# EAGLE design breakout_ina169 (EAGLE 7.5.0)
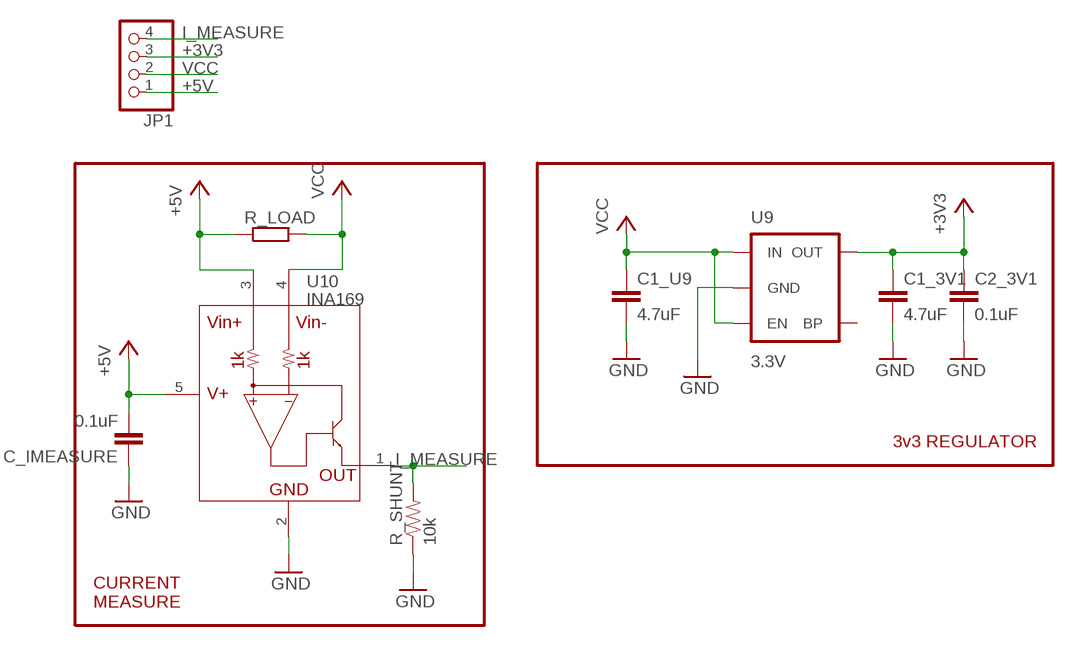
[diagram p0: schematic, sheet 1]

## Parts
C1_3V1  4.7uF  CAP0402-CAP  [0402-CAP]
C1_U9  4.7uF  CAP0402-CAP  [0402-CAP]
C2_3V1  0.1uF  CAP0402-CAP  [0402-CAP]
C_IMEASURE  0.1uF  CAP0603-CAP  [0603-CAP]
JP1  PINHD-1X4  [1X04]
R_LOAD  R-EU_0309/10  [0309/10]
R_SHUNT  10k  RESISTOR0603  [0603-RES]
U9  3.3V  V_REG_LDOSMD  [SOT23-5]
U10  INA169  [SOT23-5]

## Nets
+3V3: C1_3V1.1 C2_3V1.1 JP1.3 U9.5(OUT)
+5V [motor]: C_IMEASURE.2 JP1.1 R_LOAD.1 U10.3(VIN+) U10.5(V+)
GND [motor]: C1_3V1.2 C1_U9.2 C2_3V1.2 C_IMEASURE.1 R_SHUNT.1 U9.2(GND) U10.2(GND)
I_MEASURE: JP1.4 R_SHUNT.2 U10.1(OUT)
VCC [motor]: C1_U9.1 JP1.2 R_LOAD.2 U9.1(IN) U9.3(EN) U10.4(VIN-)
Unconnected: U9.4(BP)

## Notes on the sheet
- 3v3 REGULATOR
- CURRENT
  MEASURE

## Library data of the parts
C1_3V1 C1_U9 C2_3V1 = SparkFun:CAP: Capacitor Standard 0603 ceramic capacitor, and 0.1" leaded capacitor.
C_IMEASURE = SparkFun-Passives:CAP: Capacitor Standard 0603 ceramic capacitor, and 0.1" leaded capacitor.
JP1 = pinhead:PINHD-1X4: PIN HEADER
R_LOAD = resistor:R-EU_: RESISTOR, European symbol; SIZE: 1206; TOL: 1%
R_SHUNT = SparkFun-Resistors:RESISTOR: Resistor Basic schematic elements and footprints for 0603, 1206, and PTH resistors.; TOL: 1%
U9 = SparkFun:V_REG_LDO: Voltage Regulator LDO Standard 150mA LDO voltage regulator in SOT-23 layout. Micrel part MIC5205. BP (by-pass) pin is used to lower output noise with 470pF cap.
U10 = SparkFun-AnalogIC:INA169

## Net classes
0 default: clearance 0.205 mm
1 motor: width 0.406 mm, clearance 0.203 mm

## Board
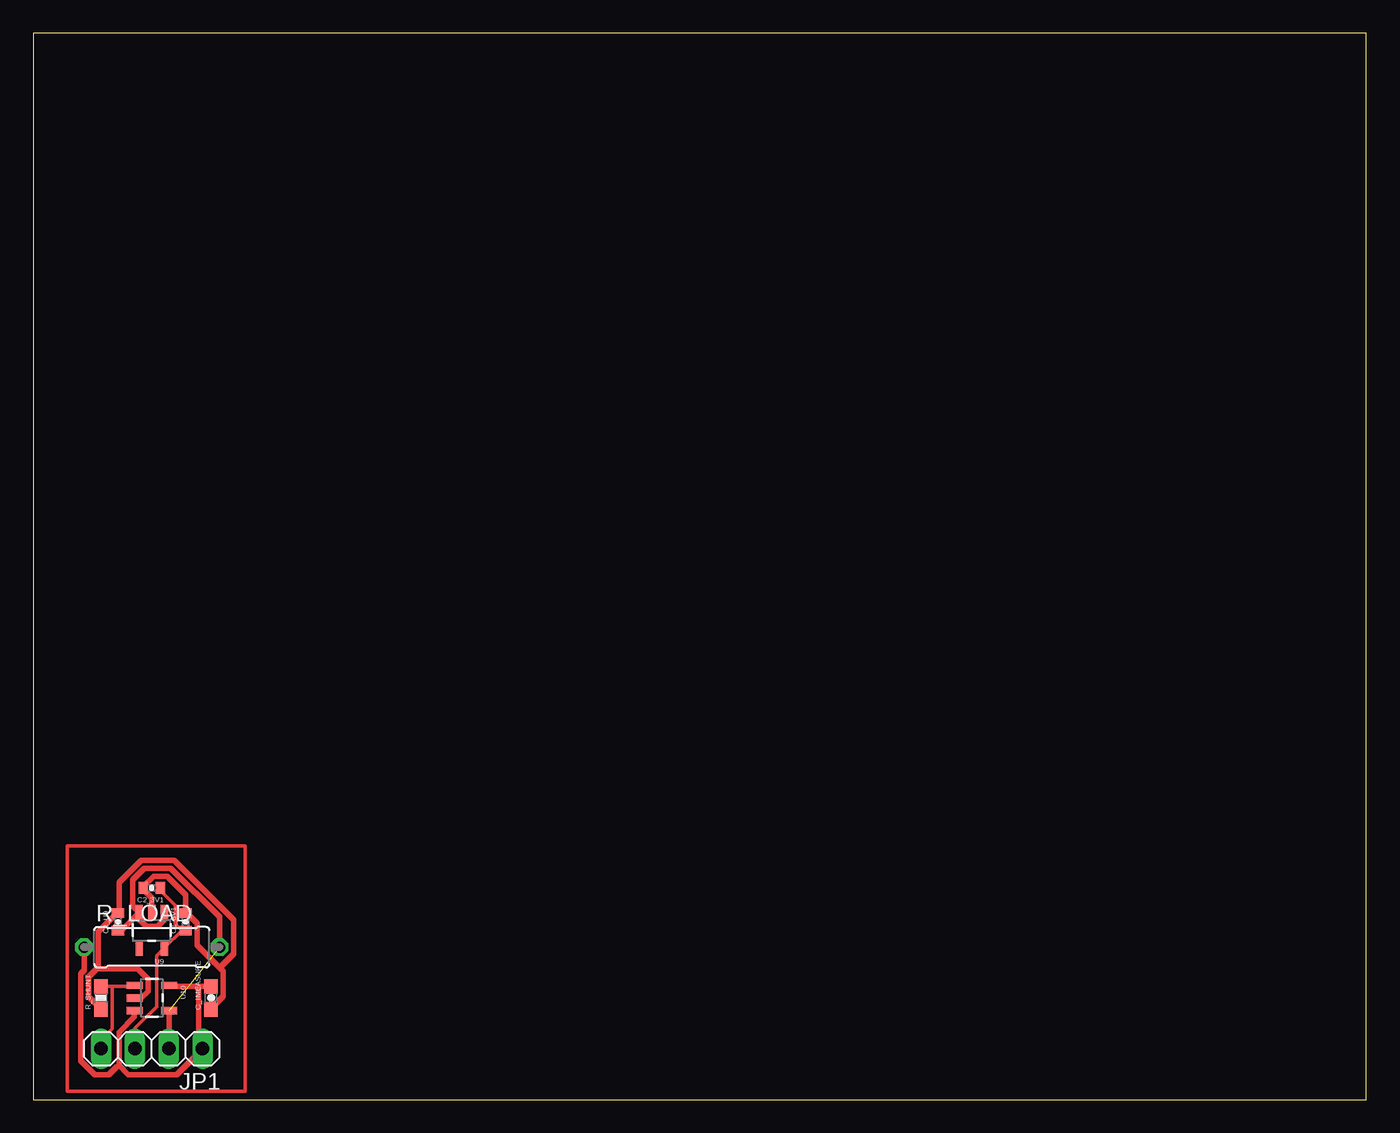
[diagram p1: board, top side]

Size 100 x 80 mm. Coordinates in mm from the lower left corner, seen from the top.
Outline: 0,0 100,0 100,80 0,80 0,0
Copper layers (1*16): Top 0.035mm / dielectric 1.5mm / Bottom 0.035mm
Design rules "default": minimum track width 10mil, minimum drill 24mil, track to track 8mil, track to pad 8mil, pad to pad 8mil, via to via 8mil, smd to smd 8mil, copper to edge 40mil, drill to drill 8mil, minimum pad ring 10mil, minimum via ring 8mil, stop-mask expansion 4mil, vias tented up to drill 0mil, thermal gap 10mil

### Footprints (pad centres in the part's own frame; a part is rotated, then mirrored left to right if it is on the bottom)
0402-CAP = smd 0.7 x 0.9: 1 -0.65,0; 2 0.65,0
0603-CAP = smd 1.1 x 1: 1 -0.85,0; 2 0.85,0
1X04 = drill 1.016 long: 1 -3.81,0; 2 -1.27,0; 3 1.27,0; 4 3.81,0
0309/10 = drill 0.813 octagon: 1 -5.08,0; 2 5.08,0
0603-RES = smd 1.1 x 1: 1 -0.85,0; 2 0.85,0
SOT23-5 = smd 0.55 x 1.2: 1 -0.95,-1.3; 2 0,-1.3; 3 0.95,-1.3; 4 0.95,1.3; 5 -0.95,1.3

### Placement (x,y rotation side)
C1_3V1  11.43,13.34 90 top
C1_U9  6.35,13.34 90 top
C2_3V1  8.89,15.88 180 top
C_IMEASURE  13.34,7.62 90 top
JP1  8.89,3.81 180 top
R_LOAD  8.89,11.43 0 top
R_SHUNT  5.08,7.62 90 top
U9  8.89,12.7 180 top
U10  8.89,7.62 270 top

### Tracks (layer width: path | path; a pad name or v marks a point on that pad's centre or on a via)
+3V3
  Top 0.254: C2_3V1.1 9.55,15.65 10.64,14.55 10.64,13.18 11.05,12.78 C1_3V1.1 11.43,12.68 11.12,12.68 9.86,11.4 U9.5 9.75,11.3 9.25,10.79 9.25,6.96 7.62,5.33 JP1.3
+5V
  Top 0.406: 12.42,8.48 10.29,8.48 10.21,8.56 U10.5 | 12.42,8.48 13.34,8.48 C_IMEASURE.2 | 6.43,2.56 6.43,5.05 7.57,6.2 7.57,6.66 U10.3 | 6.43,2.56 7.14,1.85 10.74,1.85 JP1.1 12.6,3.99 12.42,4.17 12.42,8.48 | R_LOAD.1 3.81,9.7 3.56,9.45 3.56,2.9 4.6,1.85 5.64,1.85 6.25,2.46 6.43,2.56
GND
  Top 0.406: 4.88,9.91 4.88,12.6 6.25,13.97 6.35,13.97 C1_U9.2 6.43,14.17 6.43,16.31 8.08,17.96 10.57,17.96 15.04,13.49 15.04,10.95 13.98,9.89 | 4.88,9.91 4.17,9.2 4.17,7.7 5.08,6.78 R_SHUNT.1 | U10.2 8.1,7.62 8.61,8.13 8.61,9.02 7.82,9.8 5.05,9.8 4.88,9.91 | C_IMEASURE.1 13.34,6.83 14.25,7.75 14.25,9.63 13.98,9.89 | 13.98,9.89 12.29,11.58 12.29,13.21 11.61,13.89 C1_3V1.2 11.43,15.37 10.06,16.74 9.02,16.74 8.26,15.98 8.26,15.88 C2_3V1.2 8.33,15.7 8.89,15.14 U9.2
I_MEASURE
  Top 0.254: 5.92,8.48 7.49,8.48 7.57,8.56 U10.1 | 5.92,8.48 5.08,8.48 R_SHUNT.2 | 5.92,8.48 5.92,5.31 5.08,4.47 JP1.4
N$1
  Top 0.254: 2.54,0.64 15.88,0.64 15.88,19.05 2.54,19.05 2.54,0.64
VCC  (1 unrouted)
  Top 0.406: JP1.2 10.19,3.83 10.19,6.66 U10.4 | C1_U9.1 6.63,12.7 7.92,13.99 U9.3 | U9.1 9.83,13.49 9.32,12.98 8.46,12.98 7.82,13.61 U9.3 | R_LOAD.2 13.97,13.69 10.31,17.35 8.33,17.35 7.47,16.48 7.47,14.53 7.82,14.17 U9.3